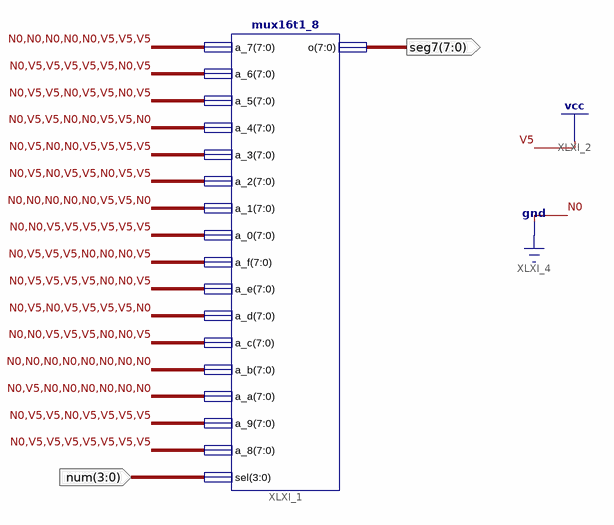
[diagram p0: schematic sheet 1]
// Xilinx ISE schematic seg7_decoder.sch (kintex7) as structural Verilog: 1 symbols, 2 ports
module seg7_decoder (
  input  [3:0] num,
  output [7:0] seg7
);

  mux16t1_8 XLXI_1 (
    .a_7(8'b00000111), .a_6(8'b01111101), .a_5(8'b01101101), .a_4(8'b01100110), .a_3(8'b01001111),
    .a_2(8'b01011011), .a_1(8'b00000110), .a_0(8'b00111111), .a_f(8'b01110001), .a_e(8'b01111001),
    .a_d(8'b01011110), .a_c(8'b00111001), .a_b({8{1'b0}}), .a_a(8'b01000000), .a_9(8'b01101111),
    .a_8(8'b01111111), .sel(num), .o(seg7));
endmodule
